# Altium project portable_inhaler_test.PrjPcb
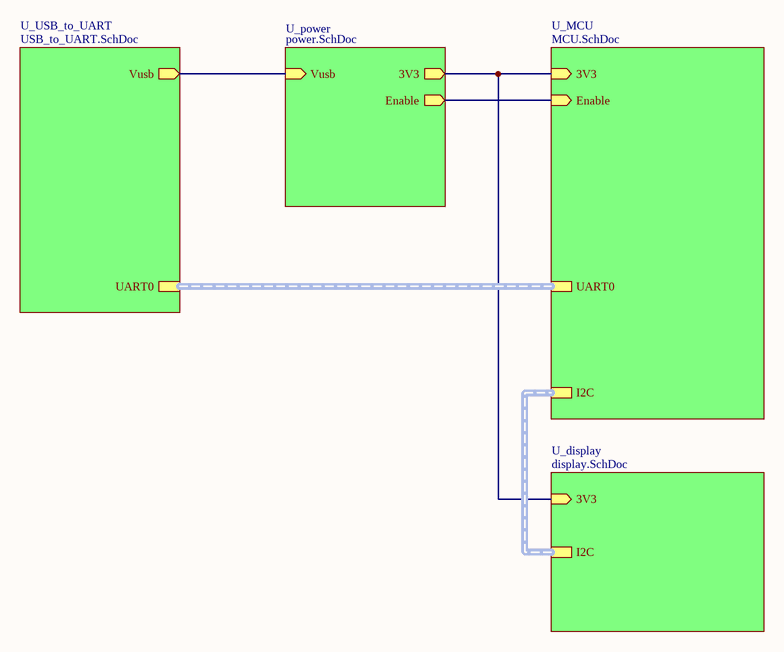
[diagram p0: block.SchDoc]
8 sheets, 26 parts. Net scope: hierarchical (ports join the sheet entries above them; power ports are global).
Board file: portable_inhaler_test v01 PCB.PcbDoc
Sheets:
  block.SchDoc
    U_MCU = MCU.SchDoc
    U_power = power.SchDoc
      U_battery = battery.SchDoc
      U_battery_charger = battery_charger.SchDoc
      U_MCU_power = MCU_power.SchDoc
    U_display = display.SchDoc
    U_USB_to_UART = USB_to_UART.SchDoc

## Sheet block.SchDoc
size 297 x 209 mm; Address1: Address1; Address2: Address2; Address3: Address3; Address4: Address4; SheetNumber: 1; Scale: 1:1; Обозначение документа: АБВГ.123456.001Э3

### Sub-sheets
U_display = display.SchDoc: I2C (harness I2C), 3V3 (in)
U_MCU = MCU.SchDoc: I2C (harness I2C), 3V3 (in), Enable (in), UART0
U_power = power.SchDoc: 3V3 (out), Enable (out), Vusb (in)
U_USB_to_UART = USB_to_UART.SchDoc: Vusb (out), UART0 (harness UART0)

### Nets
3V3: sheet U_MCU/3V3, sheet U_power/3V3, sheet U_display/3V3
NetC5_2: sheet U_power/Vusb, sheet U_USB_to_UART/Vusb
NetR3_1: sheet U_MCU/Enable, sheet U_power/Enable

### Buses and harness runs
harness sheet U_display/I2C = sheet U_MCU/I2C
harness sheet U_MCU/UART0 = sheet U_USB_to_UART/UART0

### Notes on the sheet
- Подп. и дата
- Инв. № дубл.
- Взам. инв. №
- Инв. № подл.
- Изм.
- Лист
- № докум.
- Подп.
- Дата
- Копировал
- Формат А4

## Sheet MCU.SchDoc
size 297 x 209 mm; Address1: Address1; Address2: Address2; Address3: Address3; Address4: Address4; SheetNumber: 1; Scale: 1:1; Обозначение документа: АБВГ.123456.001Э3
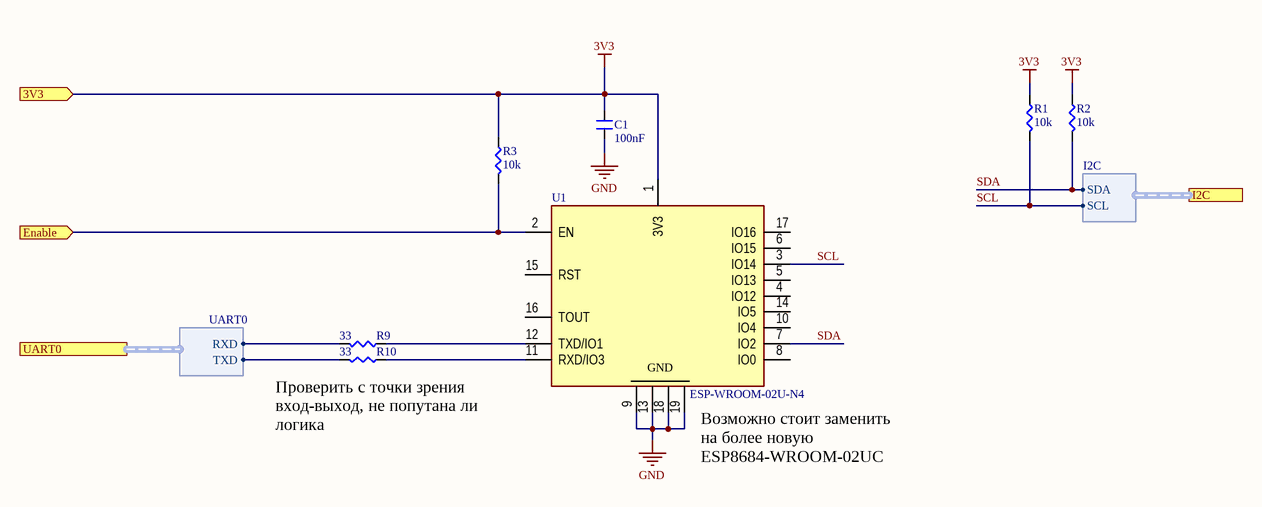
[diagram p1: MCU.SchDoc]

### Parts
C1  100nF  [CAP0603]
R1  10k  [RES0603]
R2  10k  [RES0603]
R3  10k  [RES0603]
R9  33  [RES0603]
R10  33  [RES0603]
U1  ESP-WROOM-02U-N4  [ESP-WROOM-02U-N4]

### Ports
3V3 (in), Enable (in), I2C (harness I2C), UART0 (harness UART0)

### Harnesses
I2C: SDA, SCL
UART0: TXD, RXD

### Nets
3V3: C1.2 R1.2 R2.2 R3.2 U1.1(3V3) ; port 3V3
GND: C1.1 U1.9(GND) U1.13(GND) U1.18(GND) U1.19(GND)
SCL: R1.1 U1.3(IO14) ; port I2C.SCL
SDA: R2.1 U1.7(IO2) ; port I2C.SDA
UART0RX: R9.1 ; port UART0.RXD
UART0TX: R10.1 ; port UART0.TXD
NetR3_1: R3.1 U1.2(EN) ; port Enable
NetR9_2: R9.2 U1.12(TXD/IO1)
NetR10_2: R10.2 U1.11(RXD/IO3)

Not connected (* = marked no-connect by the designer): U1 4(IO12) 5(IO13) 6(IO15) 8(IO0) 10(IO4) 14(IO5) 15(RST) 16(TOUT) 17(IO16)

### Notes on the sheet
- (near R10) Проверить с точки зрения вход-выход, не попутана ли логика
- (near U1) Возможно стоит заменить на более новую ESP8684-WROOM-02UC
- Подп. и дата
- Инв. № дубл.
- Взам. инв. №
- Инв. № подл.
- Изм.
- Лист
- № докум.
- Подп.
- Дата
- Копировал
- Формат А4

### Library data of the parts
C1 = GCM188R71H104KA57J: Tolerance ±10% / Rated Voltage 50Vdc / Temperature 0±30ppm/℃; Manufacturer: Arrow Electronics; Item: 100nF 50V  ±10%; Vdc: 50V; Part Number: GCM188R71H104KA57J; Supplier 1: Mouser; Supplier Part Number 1: 81-GCM188R71H104KA7J; Case: 0603; Tolerance: 10%; Value: 100nF; HelpURL: http://www.farnell.com/datasheets/4360.pdf?src-supplier=Element14; Category: Multilayer Ceramic Capacitors - SMD/SMT
R1-R3 = CR0603-FX-1002ELF: Tolerance ±1% / Power (Watts) 0.1W, 1/10W / Temperature Coefficient ±100ppm/°C; Manufacturer: Bourns; Item: 10k  ±1% 0.1W; Part Number: CR0603-FX-1002ELF; Supplier 1: Mouser; Supplier Part Number 1: 652-CR0603FX-1002ELF; Case: 0603; Tolerance: 1%; Value: 10k; HelpURL: https://eu.mouser.com/datasheet/2/54/cr-1858361.pdf; Category: Thin Film Resistors - SMD
R9 R10 = CR0603FX-33R0ELF: Tolerance ±1% / Power (Watts) 0.1W, 1/10W / Temperature Coefficient ±100ppm/°C; Manufacturer: Bourns; Item: 33  ±1% 0.1W; Part Number: CR0603FX-33R0ELF; Supplier 1: Mouser; Supplier Part Number 1: 652-CR0603FX-33R0ELF; Case: 0603; Tolerance: 1%; Value: 33; HelpURL: https://eu.mouser.com/datasheet/2/54/crxxxxx-1858361.pdf; Category: Thin Film Resistors - SMD
U1 = ESP-WROOM-02U-N4: ESP-WROOM-02U-N4, WiFi Modules - 802.11 SMD Module, ESP8266EX, 32Mbits SPI flash, UART Mode, U.FL antenna connector; Manufacturer: Espressif Systems; Interfaces: GPIO, HSPI, I2C, I2S. IR, PWM, UART; Vdss: 3.3V; Part Number: ESP-WROOM-02U-N4; Item: ESP-WROOM-02U-N4; Supplier 1: Chipdip; Supplier Part Number 1: 8004788563; HelpURL: https://www.espressif.com/sites/default/files/documentation/esp-wroom-02u_esp-wroom-02d_datasheet_en.pdf; Category: WiFi Modules - 802.11

## Sheet power.SchDoc
size 297 x 209 mm; Address1: Address1; Address2: Address2; Address3: Address3; Address4: Address4; SheetNumber: 1; Scale: 1:1; Обозначение документа: АБВГ.123456.001Э3
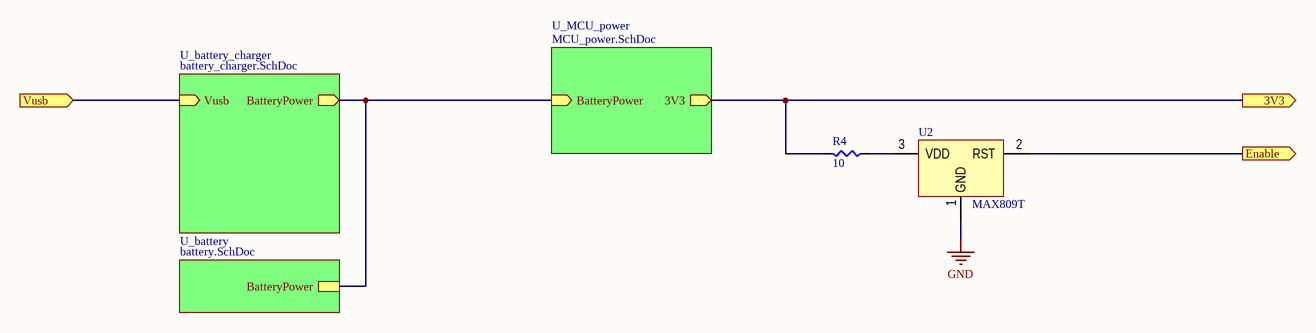
[diagram p2: power.SchDoc]

### Parts
R4  10  [RES0603]
U2  MAX809T  [SOT-23-3]

### Sub-sheets
U_battery = battery.SchDoc: BatteryPower
U_battery_charger = battery_charger.SchDoc: BatteryPower (out), Vusb (in)
U_MCU_power = MCU_power.SchDoc: BatteryPower (in), 3V3 (out)

### Ports
3V3 (out), Enable (out), Vusb (in)

### Nets
3V3: R4.1 ; port 3V3, sheet U_MCU_power/3V3
GND: U2.1(GND)
NetC5_2: port Vusb, sheet U_battery_charger/Vusb
NetJ2_1: sheet U_battery/BatteryPower, sheet U_battery_charger/BatteryPower, sheet U_MCU_power/BatteryPower
NetR3_1: U2.2(RST) ; port Enable
NetR4_2: R4.2 U2.3(VDD)

### Notes on the sheet
- Подп. и дата
- Инв. № дубл.
- Взам. инв. №
- Инв. № подл.
- Изм.
- Лист
- № докум.
- Подп.
- Дата
- Копировал
- Формат А4

### Library data of the parts
R4 = RC0603FR-0710RL: Tolerance ±1% / Power (Watts) 0.1W, 1/10W / Temperature Coefficient ±100ppm/°C; Manufacturer: YAGEO; Item: 10 ±1% 0.1W; Part Number: RC0603FR-0710RL; Supplier 1: Mouser; Supplier Part Number 1: 603-RC0603FR-0710RL; Case: 0603; Tolerance: 1%; Value: 10; HelpURL: https://www.mouser.com/datasheet/2/447/PYu_RC_Group_51_RoHS_L_11-1984063.pdf; Category: Thin Film Resistors - SMD
U2 = MAX809T: Power monitor 3.08В SOT23-3; Manufacturer: UMW; Part Number: MAX809T; Item: MAX809T; Supplier 1: ChipDip; Supplier Part Number 1: 9001067621; Case: SOT-23; HelpURL: https://static.chipdip.ru/lib/848/DOC018848681.pdf; Category: Supervisory Circuits

## Sheet battery.SchDoc
size 297 x 209 mm; Address1: Address1; Address2: Address2; Address3: Address3; Address4: Address4; SheetNumber: 1; Scale: 1:1; Обозначение документа: АБВГ.123456.001Э3
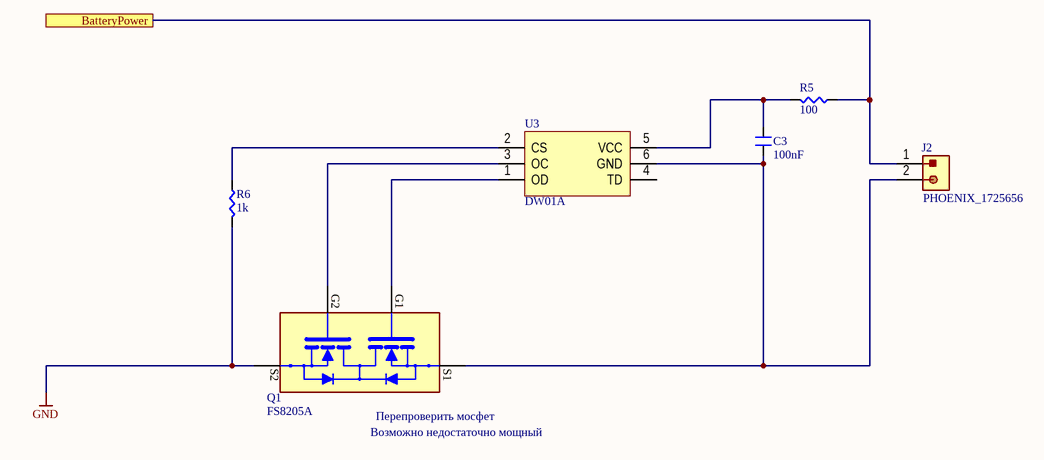
[diagram p3: battery.SchDoc]

### Parts
C3  100nF  [CAP0603]
J2  PHOENIX_1725656  [PHOENIX_1725656]
Q1  FS8205A  [TSSOP-8_MOSFET]
R5  100  [RES0603]
R6  1k  [RES0603]
U3  DW01A  [SOT-23-6]

### Ports
BatteryPower

### Nets
GND: Q1.S2 R6.1
NetC3_1: C3.1 J2.2 Q1.S1 U3.6(GND)
NetC3_2: C3.2 R5.1 U3.5(VCC)
NetJ2_1: J2.1 R5.2 ; port BatteryPower
NetQ1_G1: Q1.G1 U3.1(OD)
NetQ1_G2: Q1.G2 U3.3(OC)
NetR6_2: R6.2 U3.2(CS)

Not connected (* = marked no-connect by the designer): U3 4(TD)

### Notes on the sheet
- (near Q1) Перепроверить мосфет
- Возможно недостаточно мощный
- Подп. и дата
- Инв. № дубл.
- Взам. инв. №
- Инв. № подл.
- Изм.
- Лист
- № докум.
- Подп.
- Дата
- Копировал
- Формат А4

### Library data of the parts
C3 = GCM188R71H104KA57J: as C1 on sheet MCU; Part Number: GCM188R71H104KA57J; Supplier 1: Mouser; Supplier Part Number 1: 81-GCM188R71H104KA7J; Case: 0603; Tolerance: 10%; Value: 100nF; HelpURL: http://www.farnell.com/datasheets/4360.pdf?src-supplier=Element14; Category: Multilayer Ceramic Capacitors - SMD/SMT
J2 = 1725656: Fixed Terminal Blocks 2P 2.54mm 90DEG; Manufacturer: Phoenix Contact; Part Number: 1725656; Item: PHOENIX_1725656; Supplier 1: Mouser; Case: Female; HelpURL: https://eu.mouser.com/datasheet/2/324/4/1725656-1437410.pdf
Q1 = FS8205A: Dual N-Channel Enhancement Mode Power MOSFET; Manufacturer: Fortune Semiconductor; FET Type: 2 N-Channel (Dual) Common Drain; Vds: 20V; Id: 6A; Case: TSSOP-8; Supplier 1: Chip-Dip; Supplier Part Number 1: FS8205A; ComponentLink1Description: HelpURL; ComponentLink1URL: https://www.vishay.com/docs/76933/sisf02dn.pdf; Item: FS8205A; Part Number: FS8205A; Channel: N-Channel; HelpURL: https://www.ic-fortune.com/upload/Download/FS8205A-DS-12_EN.pdf; Category: MOSFET
R5 = 652-CR0603AFX1000ELF: Tolerance ±1% / Power (Watts) 0.1W, 1/10W / Temperature Coefficient ±100ppm/°C; Manufacturer: Bourns; Item: 100  ±1% 0.1W; Tolerance: 0.01; Part Number: 652-CR0603AFX1000ELF; Supplier 1: Mouser; Case: 0603; Value: 100; HelpURL: https://eu.mouser.com/datasheet/2/427/VISH_S_A0003599164_1-2569050.pdf; Category: Thin Film Resistors - SMD
R6 = CRT0603-FY-1001ELF: Tolerance ±1% / Power (Watts) 0.1W, 1/10W / Temperature Coefficient ±25ppm/°C; Manufacturer: Bourns; Item: 1k ±1% 0.1W; Tolerance: 0.01; Part Number: CRT0603-FY-1001ELF; Supplier 1: Mouser; Supplier Part Number 1: 652-CRT0603FY1001ELF; Case: 0603; Value: 1k; HelpURL: https://eu.mouser.com/datasheet/2/54/CRT-1649066.pdf; Category: Thin Film Resistors - SMD
U3 = DW01A: Battery Management Battery Protection IC; Manufacturer: H&M Semiconductor; Part Number: DW01A; Item: DW01A; Supplier 1: Chip-Dip; Supplier Part Number 1: DW01A; Case: SOT-23-6; HelpURL: https://hmsemi.com/downfile/DW01A.PDF; Category: Battery Management

## Sheet battery_charger.SchDoc
size 297 x 209 mm; Address1: Address1; Address2: Address2; Address3: Address3; Address4: Address4; SheetNumber: 1; Scale: 1:1; Обозначение документа: АБВГ.123456.001Э3
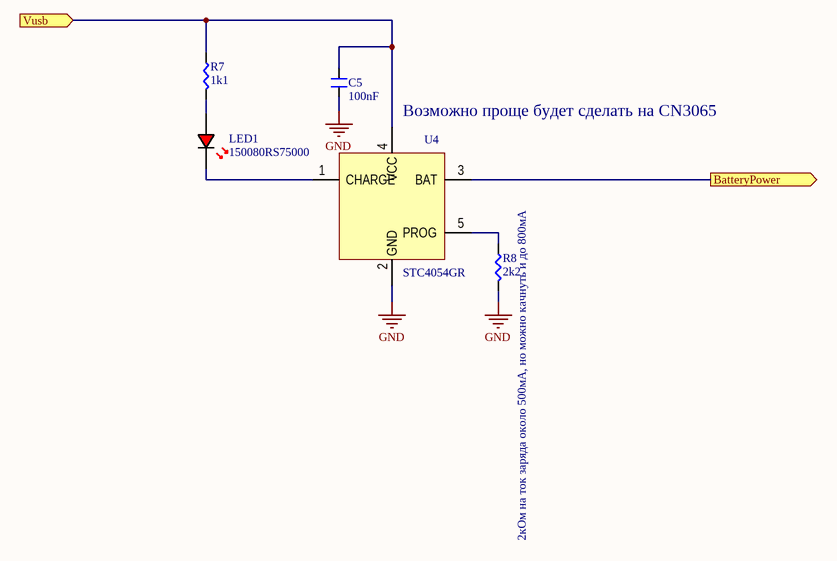
[diagram p4: battery_charger.SchDoc]

### Parts
C5  100nF  [CAP0603]
LED1  150080RS75000  [LED0805]
R7  1k1  [RES0603]
R8  2k2  [RES0603]
U4  STC4054GR  [SOT-23-5]

### Ports
BatteryPower (out), Vusb (in)

### Nets
GND: C5.1 R8.1 U4.2(GND)
NetC5_2: C5.2 R7.2 U4.4(VCC) ; port Vusb
NetJ2_1: U4.3(BAT) ; port BatteryPower
NetLED1_A: LED1.A R7.1
NetLED1_C: LED1.C U4.1(CHARGE)
NetR8_2: R8.2 U4.5(PROG)

### Notes on the sheet
- (near U4) Возможно проще будет сделать на CN3065
- (near R8) 2кОм на ток заряда около 500мА, но можно качнуть и до 800мА
- Подп. и дата
- Инв. № дубл.
- Взам. инв. №
- Инв. № подл.
- Изм.
- Лист
- № докум.
- Подп.
- Дата
- Копировал
- Формат А4

### Library data of the parts
C5 = GCM188R71H104KA57J: as C1 on sheet MCU; Part Number: GCM188R71H104KA57J; Supplier 1: Mouser; Supplier Part Number 1: 81-GCM188R71H104KA7J; Case: 0603; Tolerance: 10%; Value: 100nF; HelpURL: http://www.farnell.com/datasheets/4360.pdf?src-supplier=Element14; Category: Multilayer Ceramic Capacitors - SMD/SMT
LED1 = 150080RS75000: Standard LEDs - SMD WL-SMCW SMDMono TpVw Waterclr 0805 Red; Manufacturer: Wurth Elektronik; Imax: 20 mA; Value: 2V; Part Number: 150080RS75000; Item: 150080RS75000; Supplier 1: Mouser; Supplier Part Number 1: 710-150080RS75000; Color: Red; Case: 0805; HelpURL: https://eu.mouser.com/datasheet/2/445/150080VS75000-3085206.pdf; Category: Standard LEDs - SMD
R7 = ERJ-3EKF1101V: Tolerance ±1% / Power (Watts) 0.1W, 1/10W / Temperature Coefficient ±100ppm/°C; Manufacturer: Panasonic; Item: 1k1  ±1% 0.1W; Part Number: ERJ-3EKF1101V; Supplier 1: Mouser; Supplier Part Number 1: 667-ERJ-3EKF1101V; Case: 0603; Tolerance: 1%; Value: 1k1; HelpURL: https://eu.mouser.com/datasheet/2/315/AOA0000C304-1149620.pdf; Category: Thin Film Resistors - SMD
R8 = 541-2.20KHCT-ND: Tolerance ±1% / Power (Watts) 0.1W, 1/10W / Temperature Coefficient ±100ppm/°C; Manufacturer: Vishay Dale; Item: 2k2 ±1% 0.1W; Part Number: 541-2.20KHCT-ND; Supplier 1: Digi-Key; Case: 0603; Tolerance: 1%; Value: 2k2; HelpURL: http://www.farnell.com/datasheets/2111203.pdf?src-supplier=Element14; Category: Thin Film Resistors - SMD
U4 = STC4054GR: 800mA Standalone linear Li-Ion / Battery charger with thermal regulation; Manufacturer: STMicroelectronics; Part Number: STC4054GR; Item: STC4054GR; Supplier 1: ChipDip; Supplier Part Number 1: 9000208263; Case: TSOT-23-5; HelpURL: https://static.chipdip.ru/lib/264/DOC029264196.pdf; Category: Battery Management

## Sheet MCU_power.SchDoc
size 297 x 209 mm; Address1: Address1; Address2: Address2; Address3: Address3; Address4: Address4; SheetNumber: 1; Scale: 1:1; Обозначение документа: АБВГ.123456.001Э3
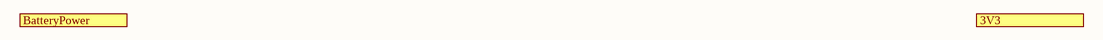
[diagram p5: MCU_power.SchDoc]

### Ports
3V3 (out), BatteryPower (in)

### Notes on the sheet
- Подп. и дата
- Инв. № дубл.
- Взам. инв. №
- Инв. № подл.
- Изм.
- Лист
- № докум.
- Подп.
- Дата
- Копировал
- Формат А4

## Sheet display.SchDoc
size 297 x 209 mm; Address1: Address1; Address2: Address2; Address3: Address3; Address4: Address4; SheetNumber: 1; Scale: 1:1; Обозначение документа: АБВГ.123456.001Э3
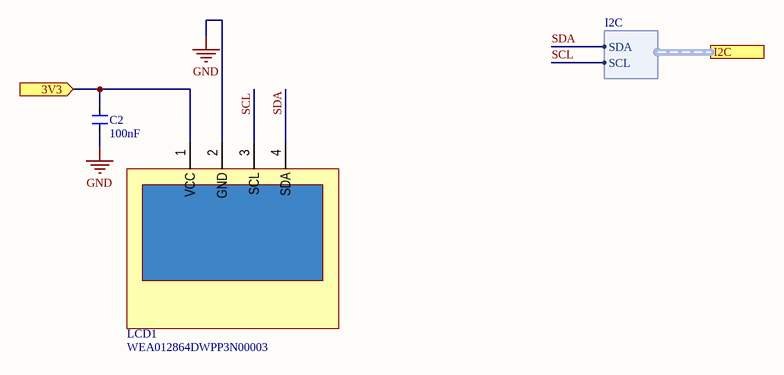
[diagram p6: display.SchDoc]

### Parts
C2  100nF  [CAP0603]
LCD1  WEA012864DWPP3N00003  [WEA012864DWPP3N00003]

### Ports
3V3 (in), I2C (harness I2C)

### Harnesses
I2C: SDA, SCL

### Nets
3V3: C2.2 LCD1.1(VCC) ; port 3V3
GND: C2.1 LCD1.2(GND)
SCL: LCD1.3(SCL) ; port I2C.SCL
SDA: LCD1.4(SDA) ; port I2C.SDA

### Notes on the sheet
- Подп. и дата
- Инв. № дубл.
- Взам. инв. №
- Инв. № подл.
- Изм.
- Лист
- № докум.
- Подп.
- Дата
- Копировал
- Формат А4

### Library data of the parts
C2 = GCM188R71H104KA57J: as C1 on sheet MCU; Part Number: GCM188R71H104KA57J; Supplier 1: Mouser; Supplier Part Number 1: 81-GCM188R71H104KA7J; Case: 0603; Tolerance: 10%; Value: 100nF; HelpURL: http://www.farnell.com/datasheets/4360.pdf?src-supplier=Element14; Category: Multilayer Ceramic Capacitors - SMD/SMT
LCD1 = WEA012864DWPP3N00003: OLED 0.96" display, 128x64, white,  IC SSD1306BZ, I2C, 3v, -40...+80°С; Manufacturer: Winstar; Part Number: WEA012864DWPP3N00003; Item: WEA012864DWPP3N00003; Supplier 1: ChipDip; Supplier Part Number 1: 8001808254; Case: none; HelpURL: https://www.compel.ru/item-pdf/bf9bb7bf1ce7223b4efcb84e5467b96d/pn/winstar~wea012864dwpp3n00003.pdf; Category: OLED displays

## Sheet USB_to_UART.SchDoc
size A4
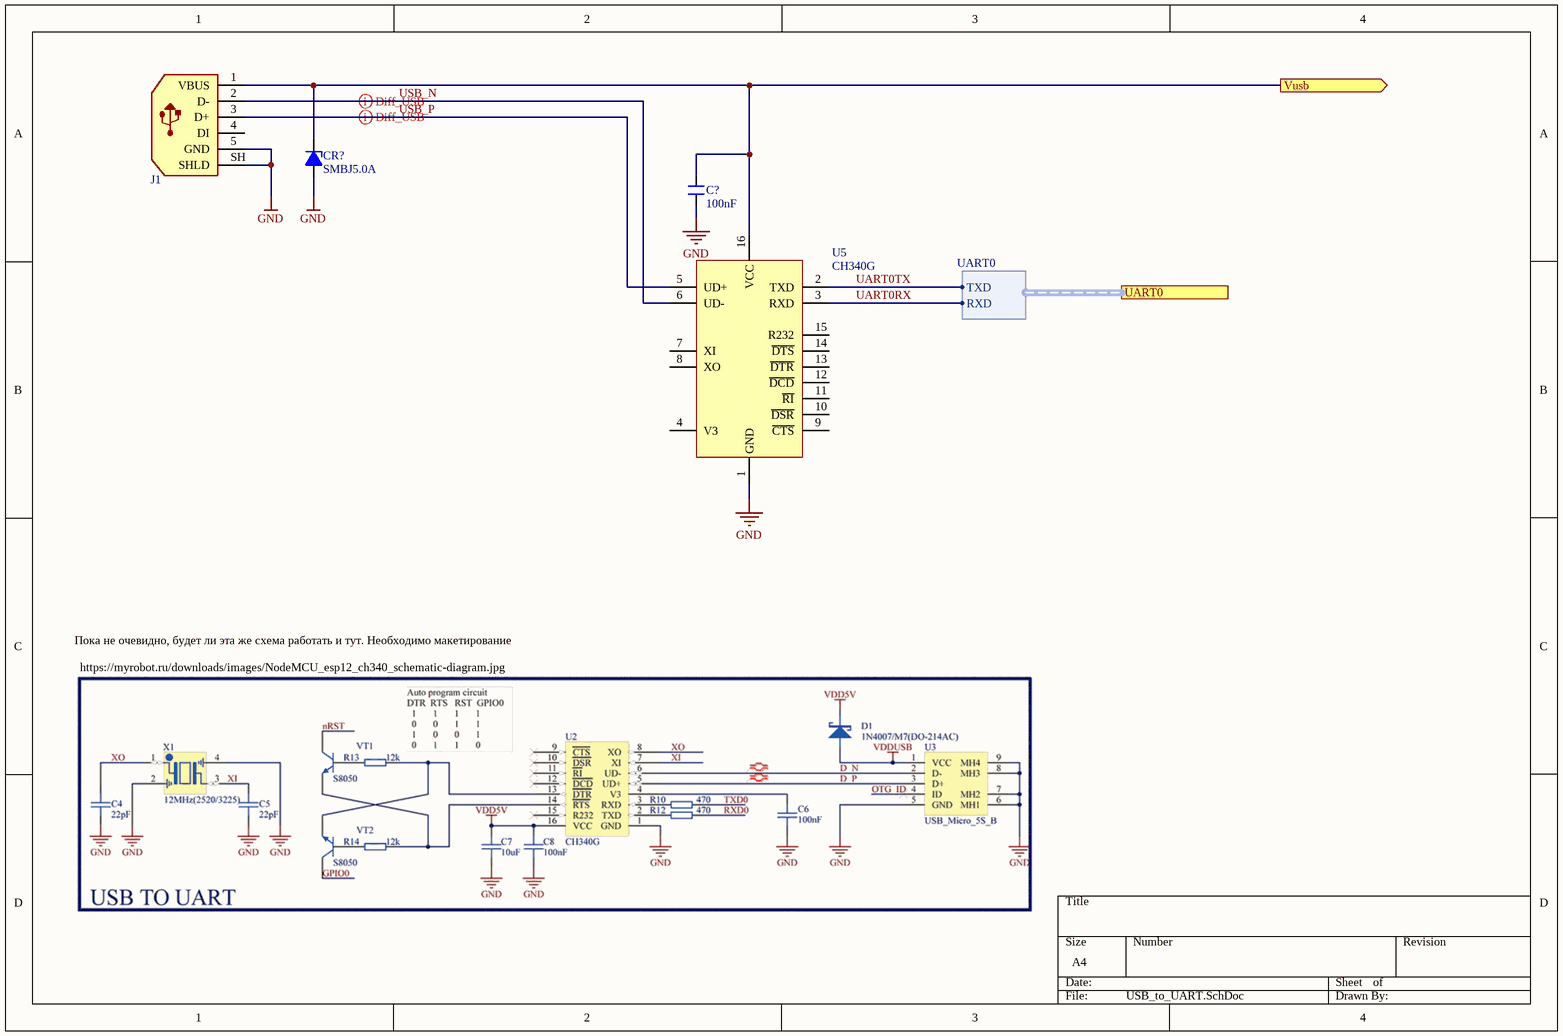
[diagram p7: USB_to_UART.SchDoc]

### Parts
C?  100nF  [CAP0603]
CR?  SMBJ5.0A  [DO-214AA-2_SMB]
J1  mini-USB female  [L-KLS1-229-5FC]  (value not drawn)
U5  CH340G  [SOIC-16]

### Ports
UART0 (harness UART0), Vusb (out)

### Harnesses
UART0: TXD, RXD

### Nets
GND: C?.1 CR?.2(A) J1.5(GND) J1.SH(SHLD) U5.1(GND)
UART0RX: U5.3(RXD) ; port UART0.RXD
UART0TX: U5.2(TXD) ; port UART0.TXD
USB_N: J1.2(D-) U5.6(UD-)
USB_P: J1.3(D+) U5.5(UD+)
NetC5_2: C?.2 CR?.1(C) J1.1(VBUS) U5.16(VCC) ; port Vusb

Not connected (* = marked no-connect by the designer): J1 4(DI); U5 4(V3) 7(XI) 8(XO) 9(~{CTS}) 10(~{DSR}) 11(~{RI}) 12(~{DCD}) 13(~{DTR}) 14(~{DTS}) 15(R232)

### Layout directives
differential pair; differential pair class USB; net class Diff_USB: USB_N, USB_P

### Notes on the sheet
- Пока не очевидно, будет ли эта же схема работать и тут. Необходимо макетирование
- https://myrobot.ru/downloads/images/NodeMCU_esp12_ch340_schematic-diagram.jpg

### Library data of the parts
C? = GCM188R71H104KA57J: as C1 on sheet MCU; Part Number: GCM188R71H104KA57J; Supplier 1: Mouser; Supplier Part Number 1: 81-GCM188R71H104KA7J; Case: 0603; Tolerance: 10%; Value: 100nF; HelpURL: http://www.farnell.com/datasheets/4360.pdf?src-supplier=Element14; Category: Multilayer Ceramic Capacitors - SMD/SMT
CR? = SMBJ5.0A: ESD Suppressors / TVS Diodes 600W 5V Unidirect; Manufacturer: Bourns; Part Number: SMBJ5.0A; Item: SMBJ5.0A; Supplier 1: Mouser; Vdss: 5V; Case: DO-214AA-2; HelpURL: https://eu.mouser.com/datasheet/2/54/smbj-778392.pdf; Category: ESD Suppressors / TVS Diodes
J1 = L-KLS1-229-5FC: USB Connectors MINI USB B; Manufacturer: KLS; Item: USB Mini B; Part Number: L-KLS1-229-5FC; Supplier 1: Belcip; Supplier Part Number 1: 07959; Case: Female; HelpURL: https://belchip.by/sitedocs/00007959.pdf; Category: USB Connectors
U5 = CH340G: USB to UART Converter; Manufacturer: Nanjing Qinheng Microelectronics Co., Ltd.; Part Number: CH340G; Item: CH340G; Supplier 1: ChipDip; Supplier Part Number 1: 9000890746; Case: SO16; HelpURL: https://static.chipdip.ru/lib/375/DOC030375417.pdf; Category: USB to UART Interface IC

## Nets that join several sheets
3V3: MCU (5 pins), power (R4.1), display (C2.2 LCD1.1)
GND: MCU (5 pins), power (U2.1), battery (Q1.S2 R6.1), battery_charger (C5.1 R8.1 U4.2), display (C2.1 LCD1.2), USB_to_UART (5 pins)
NetC5_2: battery_charger (C5.2 R7.2 U4.4), USB_to_UART (C?.2 CR?.1 J1.1 U5.16)
NetJ2_1: battery (J2.1 R5.2), battery_charger (U4.3)
NetR3_1: MCU (R3.1 U1.2), power (U2.2)
SCL: MCU (R1.1 U1.3), display (LCD1.3)
SDA: MCU (R2.1 U1.7), display (LCD1.4)
UART0RX: MCU (R9.1), USB_to_UART (U5.3)
UART0TX: MCU (R10.1), USB_to_UART (U5.2)